# Altium schematic sheet Memory.SchDoc
size A; SheetNumber: 6; SheetTotal: 7
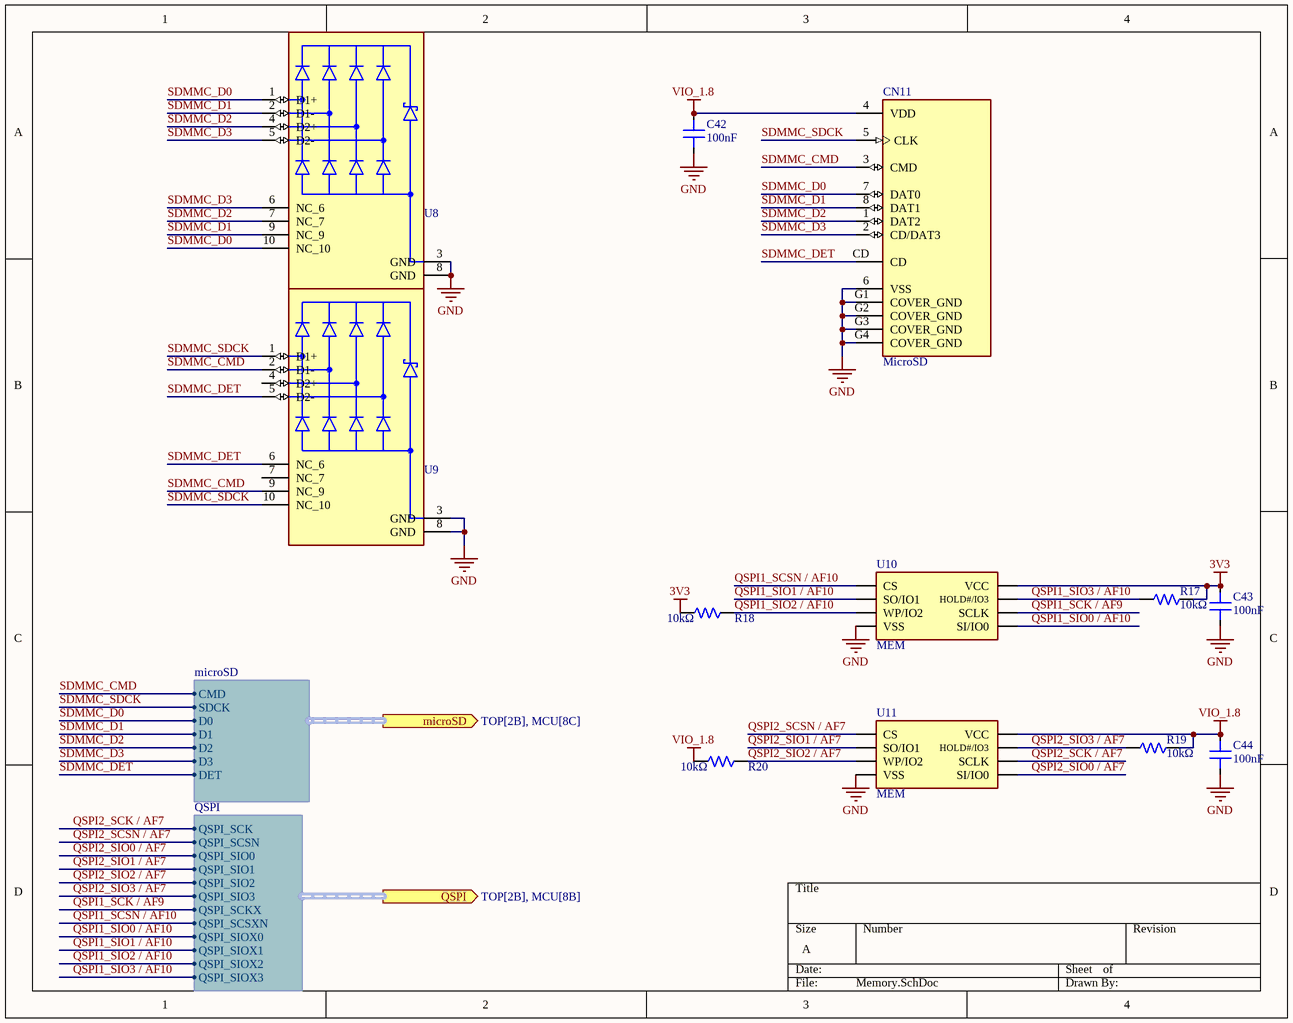
[diagram p0: Memory.SchDoc]

## Parts
C42  Capacitance: 100nF  [C_0603]  (hidden comment: CAP CER 100nF 50V X7R 0603)
C43  Capacitance: 100nF  [C_0603]  (hidden comment: CAP CER 100nF 50V X7R 0603)
C44  Capacitance: 100nF  [C_0603]  (hidden comment: CAP CER 100nF 50V X7R 0603)
CN11  MicroSD  [CONN MICRO SD PUSH PUSH]
R17  Resistance: 10kΩ  [R_0603]  (hidden comment: RES 10kΩ ±1% 100mW 0603)
R18  Resistance: 10kΩ  [R_0603]  (hidden comment: RES 10kΩ ±1% 100mW 0603)
R19  Resistance: 10kΩ  [R_0603]  (hidden comment: RES 10kΩ ±1% 100mW 0603)
R20  Resistance: 10kΩ  [R_0603]  (hidden comment: RES 10kΩ ±1% 100mW 0603)
U8  TVS DIODE 5.5VWM 14VC USON-10(1x2.5)  [USON-10]  (value not drawn)
U9  TVS DIODE 5.5VWM 14VC USON-10(1x2.5)  [USON-10]  (value not drawn)
U10  MEM  [SOP-8-208MIL]
U11  MEM  [SOP-8-208MIL]

## Ports
microSD (out, harness microSD, see TOP[2B], MCU[8C]), QSPI (out, harness QSPI, see TOP[2B], MCU[8B])

## Harnesses
QSPI: QSPI_SCK, QSPI_SCSN, QSPI_SIO0, QSPI_SIO1, QSPI_SIO2, QSPI_SIO3, QSPI_SCSXN, QSPI_SIOX0, QSPI_SIOX1, QSPI_SIOX2, QSPI_SIOX3, QSPI_SCKX
microSD: CMD, SDCK, D0, D1, D2, D3, DET

## Nets
3V3: C43.2 R17.2 R18.1 U10.8(VCC)
GND: C42.1 C43.1 C44.1 CN11.6(VSS) CN11.G1(COVER_GND) CN11.G2(COVER_GND) CN11.G3(COVER_GND) CN11.G4(COVER_GND) U8.3(GND) U8.8(GND) U9.3(GND) U9.8(GND) U10.4(VSS) U11.4(VSS)
VIO_1.8: C42.2 C44.2 CN11.4(VDD) R19.2 R20.1 U11.8(VCC)
QSPI1_SCK / AF9: U10.6(SCLK) ; port QSPI.QSPI_SCKX
QSPI1_SCSN / AF10: U10.1(CS) ; port QSPI.QSPI_SCSXN
QSPI1_SIO0 / AF10: U10.5(SI/IO0) ; port QSPI.QSPI_SIOX0
QSPI1_SIO1 / AF10: U10.2(SO/IO1) ; port QSPI.QSPI_SIOX1
QSPI1_SIO2 / AF10: R18.2 U10.3(WP/IO2) ; port QSPI.QSPI_SIOX2
QSPI1_SIO3 / AF10: R17.1 U10.7(HOLD#/IO3) ; port QSPI.QSPI_SIOX3
QSPI2_SCK / AF7: U11.6(SCLK) ; port QSPI.QSPI_SCK
QSPI2_SCSN / AF7: U11.1(CS) ; port QSPI.QSPI_SCSN
QSPI2_SIO0 / AF7: U11.5(SI/IO0) ; port QSPI.QSPI_SIO0
QSPI2_SIO1 / AF7: U11.2(SO/IO1) ; port QSPI.QSPI_SIO1
QSPI2_SIO2 / AF7: R20.2 U11.3(WP/IO2) ; port QSPI.QSPI_SIO2
QSPI2_SIO3 / AF7: R19.1 U11.7(HOLD#/IO3) ; port QSPI.QSPI_SIO3
SDMMC_CMD: CN11.3(CMD) U9.2(D1-) U9.9(NC_9) ; port microSD.CMD
SDMMC_D0: CN11.7(DAT0) U8.1(D1+) U8.10(NC_10) ; port microSD.D0
SDMMC_D1: CN11.8(DAT1) U8.2(D1-) U8.9(NC_9) ; port microSD.D1
SDMMC_D2: CN11.1(DAT2) U8.4(D2+) U8.7(NC_7) ; port microSD.D2
SDMMC_D3: CN11.2(CD/DAT3) U8.5(D2-) U8.6(NC_6) ; port microSD.D3
SDMMC_DET: CN11.CD U9.5(D2-) U9.6(NC_6) ; port microSD.DET
SDMMC_SDCK: CN11.5(CLK) U9.1(D1+) U9.10(NC_10) ; port microSD.SDCK

Not connected (* = marked no-connect by the designer): U9 4(D2+) 7(NC_7)

## Library data of the parts
C42-C44 = CC0603KRX7R9BB104: 100nF ±10% 50V Ceramic Capacitor X7R 0603; Manufacturer: YAGEO; Symbol Path 1: Symbols\Standard.SchLib; Unit Price (USD): 0.0175; Voltage Rating: 50V; MPN: CC0603KRX7R9BB104; LCSC Part #: C14663; Package: 0603; JLC Part Type: Basic; LCSC Stock: 10701000; JLC Stock: 72739428; MOQ: 50; Datasheet: https://datasheet.lcsc.com/datasheet/pdf/23ccee80ee542e7cf156a772bb589942.pdf?productCode=C14663; URL: https://www.lcsc.com/product-detail/C14663.html; Status: ok; Tolerance: ±10%; TempCo: X7R
CN11 = TF PUSH: CONN Micro SD PUSH PUSH; Supplier 1: LCSC; Supplier Part Number 1: C393941
R17-R20 = 0603WAF1002T5E: 10kΩ ±1% 100mW 0603 Thick Film Resistor; Manufacturer: UNI-ROYAL; Symbol Path 1: Symbols\Standard.SchLib; Unit Price (USD): 0.0067; Voltage Rating: 75V; TempCo: ±100ppm/℃; MPN: 0603WAF1002T5E; Package: 0603; Datasheet: https://datasheet.lcsc.com/datasheet/pdf/0a975aaa49b7c97f38a963127be4a823.pdf?productCode=C25804; Power: 100mW; LCSC Part #: C25804; JLC Part Type: Basic; LCSC Stock: 0; JLC Stock: 6329063; MOQ: 100; URL: https://www.lcsc.com/product-detail/C25804.html; Status: ok; Tolerance: ±1%; Composition: Thick Film Resistor
U8 U9 = TPD4E05U06DQAR: 14VC Clamp 2.5A@8/20us Ipp TVS DIODE USON-10(1x2.5); Manufacturer: TI; Symbol Path 1: Symbols\Standard.SchLib; Unit Price (USD): 0.0873; Reverse Standoff: 5.5V; Breakdown: 6.5V; Clamping: 14V; Channels: 4; Polarity: Unidirectional; Power: 40W@8/20us; MPN: TPD4E05U06DQAR; LCSC Part #: C138714; Package: USON-10(1x2.5); JLC Part Type: Extended; LCSC Stock: 52940; JLC Stock: 53051; MOQ: 5; Datasheet: https://datasheet.lcsc.com/datasheet/pdf/86fce5e377410b6c2d1b0526f306f55e.pdf?productCode=C138714; URL: https://www.lcsc.com/product-detail/C138714.html; Status: ok
U10 U11 = GD25Q64ESIG: Dual and Quad Serial Flash; Manufacturer: GigaDevice Semicon Beijing; Symbol Path 1: Symbols\Standard_ICs.SchLib; Unit Price (USD): 1.1517; MPN: GD25Q64ESIG; LCSC Part #: C2685734; Package: SOP-8-208mil; JLC Part Type: Extended; LCSC Stock: 19620; JLC Stock: 20563; MOQ: 1; Datasheet: https://datasheet.lcsc.com/datasheet/pdf/a31f588afce107d61ae8a979f5ece625.pdf?productCode=C2685734; URL: https://www.lcsc.com/product-detail/C2685734.html; Status: ok; Category: Memory; Subcategory: Memory